# Altium schematic sheet rele.SchDoc
size A4; SheetNumber: 3; SheetTotal: 7
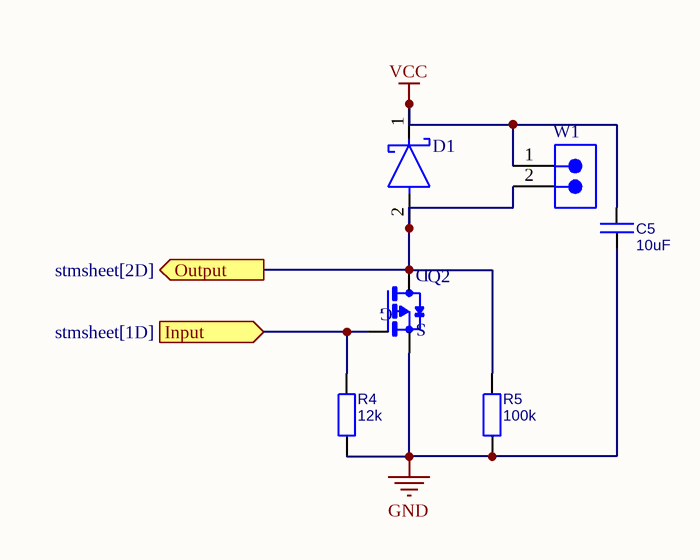
[diagram p0: rele.SchDoc]

## Parts
C5  10uF  [C0603]
D1  STPS0560Z  [FP-SOD-123-MFG]  (value not drawn)
Q2  SI2323DS-T1-GE3  [SOT23]  (value not drawn)
R4  12k  [R0603]
R5  100k  [R0603]
W1  (no value)  [691321100002]

## Ports
Input (in, see stmsheet[1D]), Output (out, see stmsheet[2D])

## Nets
GND: C5.2 Q2.2(S) R4.2 R5.2
VCC: C5.1 D1.1(C) W1.1
Input: Q2.1(G) R4.1 ; port Input
Output: D1.2(A) Q2.3(D) R5.1 W1.2 ; port Output

## Library data of the parts
C5 = C: Capacitor; Value: 10uF
D1 = CMP-12187-000036-1: DIODE SCHOTTKY 60V 500MA SOD123; Additional Feature: FREE WHEELING DIODE; Polarity: Standard; Max Forward Surge Current (Ifsm): 5.5A; Number of Elements: 1; Max Reverse Current: 50uA; Diode Element Material: SILICON; Number of Terminals/Pins: 2; Package Body Material: Plastic; Element Configuration: Single; Forward Voltage: 660mV; Terminal Form: Gull Wing; Output Current: 500mA; Series: -; Package Quantity: 1; Max Reverse Voltage (DC): 60V; Width: 1.7mm; Voltage Rating (DC): 60V; Height: 1.35mm; Packaging: Tape and Reel; Max Repetitive Reverse Voltage (Vrrm): 60V; Max Surge Current: 5.5A; Package Shape: Rectangular; REACH SVHC: No SVHC; Average Rectified Current: 500mA; JESD-30 Code: R-PDSO-G2; Terminal Position: DUAL; RoHS Compliant: Yes; Surface Mount: Yes; Peak Non-Repetitive Surge Current: 5.5A; Contact Plating: Tin; Max Reverse Leakage Current: 50uA; Length: 2.85mm; Number of Pins: 2; Radiation Hardening: No; Mount: Surface Mount; Forward Current: 500mA; Max Operating Temperature: 150°C; Min Operating Temperature: -65°C; Weight: 0.01lb; Lead Free: Lead Free; Technology: SCHOTTKY; Current Rating: 500mA
Q2 = SI2323DS-T1-GE3: P-Channel 20V 3.7A (Ta) 750mW (Ta) Surface Mount SOT-23-3 (TO-236); MF: Vishay; Package: SOT-23-3 Vishay; Price: None; Value: *; SnapEDA_Link: https://www.snapeda.com/parts/SI2323DS-T1-GE3/Vishay%20Siliconix/view-part/1098074/?ref=snap; MP: SI2323DS-T1-GE3; Availability: Unavailable
R4 R5 = R
  R4: Value: 12k
  R5: Value: 100k
W1 = CMP-1502-01783-2: NexarPartId: 18818340; Current Rating: 10A; Voltage: 300V; Pitch: 3.5052mm; Number of Contacts: 2; Number of Levels: 1; Gender: Male; Termination: Solder; Lead Free: Lead Free; Number of Rows: 1; Contact Material: Brass; Width: 8.1mm; Length: 7mm; Voltage Rating: 300V; Min Operating Temperature: -40°C; Number of Pins: 2; Height: 7.2mm; Mount: Through Hole; Max Operating Temperature: 105°C; RoHS: Compliant; Orientation: Vertical; Number of Positions Per Level: 2; Current: 10A; REACH SVHC: Unknown; Color: Green; Lead Pitch: 3.5mm; Packaging: Box